# EAGLE design tvac_systems_interface (EAGLE 9.5.0)
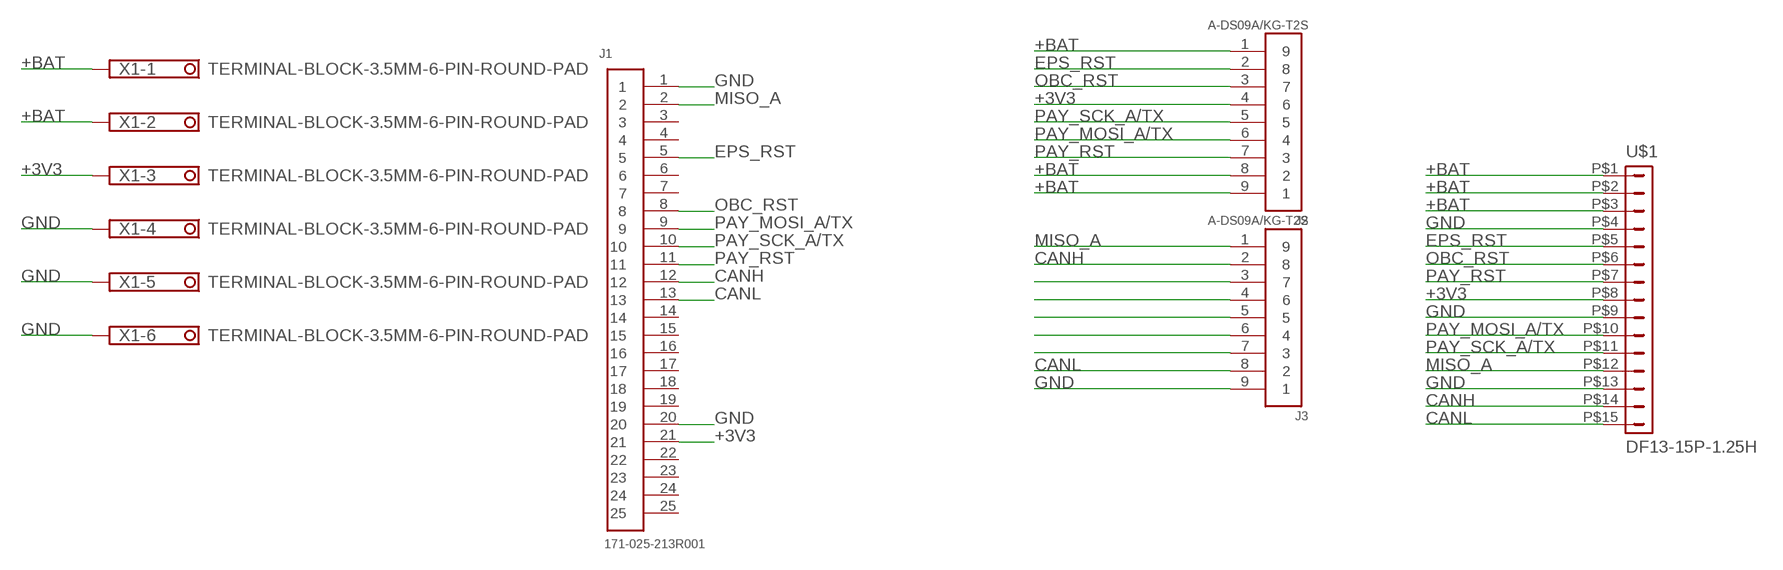
[diagram p0: schematic, sheet 1]

## Parts
J1  171-025-213R001  [171-025-213R001]
J2  A-DS09A/KG-T2S  [A-DS09A/KG-T2S]
J3  A-DS09A/KG-T2S  [A-DS09A/KG-T2S]
U$1  DF13-15P-1.25H  [DF13A-15P-1.25H]
X1  TERMINAL-BLOCK-3.5MM-6-PIN-ROUND-PAD  [TERMINAL-BLOCK-6-PIN-3.5MM-ROUND-PAD]

## Nets
+3V3 [power]: J1.21 J2.4 U$1.P$8 X1.3
+BAT [BAT]: J2.1 J2.8 J2.9 U$1.P$1 U$1.P$2 U$1.P$3 X1.1 X1.2
CANH: J1.12 J3.2 U$1.P$14
CANL: J1.13 J3.8 U$1.P$15
EPS_RST: J1.5 J2.2 U$1.P$5
GND [power]: J1.1 J1.20 J3.9 U$1.P$4 U$1.P$9 U$1.P$13 X1.4 X1.5 X1.6
MISO_A: J1.2 J3.1 U$1.P$12
N$11: J3.3
N$12: J3.4
N$13: J3.5
N$14: J3.6
N$15: J3.7
OBC_RST: J1.8 J2.3 U$1.P$6
PAY_MOSI_A/TX: J1.9 J2.6 U$1.P$10
PAY_RST: J1.11 J2.7 U$1.P$7
PAY_SCK_A/TX: J1.10 J2.5 U$1.P$11
Unconnected: J1.3 J1.4 J1.6 J1.7 J1.14 J1.15 J1.16 J1.17 J1.18 J1.19 J1.22 J1.23 J1.24 J1.25

## Library data of the parts
J1 = D-Sub Connectors:171-025-213R001: CONN D-SUB RCPT 25P PNL MNT SLDR Manufacturer's datasheet <https://www.norcomp.net/rohspdfs/Connectors/17Y/171/171-YYY-213RYY1.pdf>; CREATED_BY: PCBLayout.com; DIGIKEY_PART_NO: 4225FE-ND; MANUFACTURER: NorComp Inc.; MPN: 171-025-213R001
J2 J3 = D-Sub Connectors:A-DS09A/KG-T2S: CONN D-SUB PLUG 9POS R/A SOLDER Manufacturer's datasheet <http://www.assmann-wsw.com/fileadmin/datasheets/ASS_4888_CO.pdf>; CREATEDBY: PCBLayout.com; DIGI_KEY_PART_NUMBER: AE10968-ND; MANUFACTURER: Assmann WSW Components; MPN: A-DS 09 A/KG-T2S
U$1 = con-hirose-df13:DF13-15P-1.25: DF13-15P 1.25mm Pitch Miniature Crimping Connector.
X1 = Rembrandt Electronics - Terminal Block 3-5mm v1-0:TERMINAL-BLOCK-3.5MM-6-PIN: Terminal Block 3.5mm Pitch: 3,5 mm Number of pins: 6 Created by Rembrandt Electronics www.rembrandtelectronics.com

## Net classes
1 power: width 0.762 mm

## Board
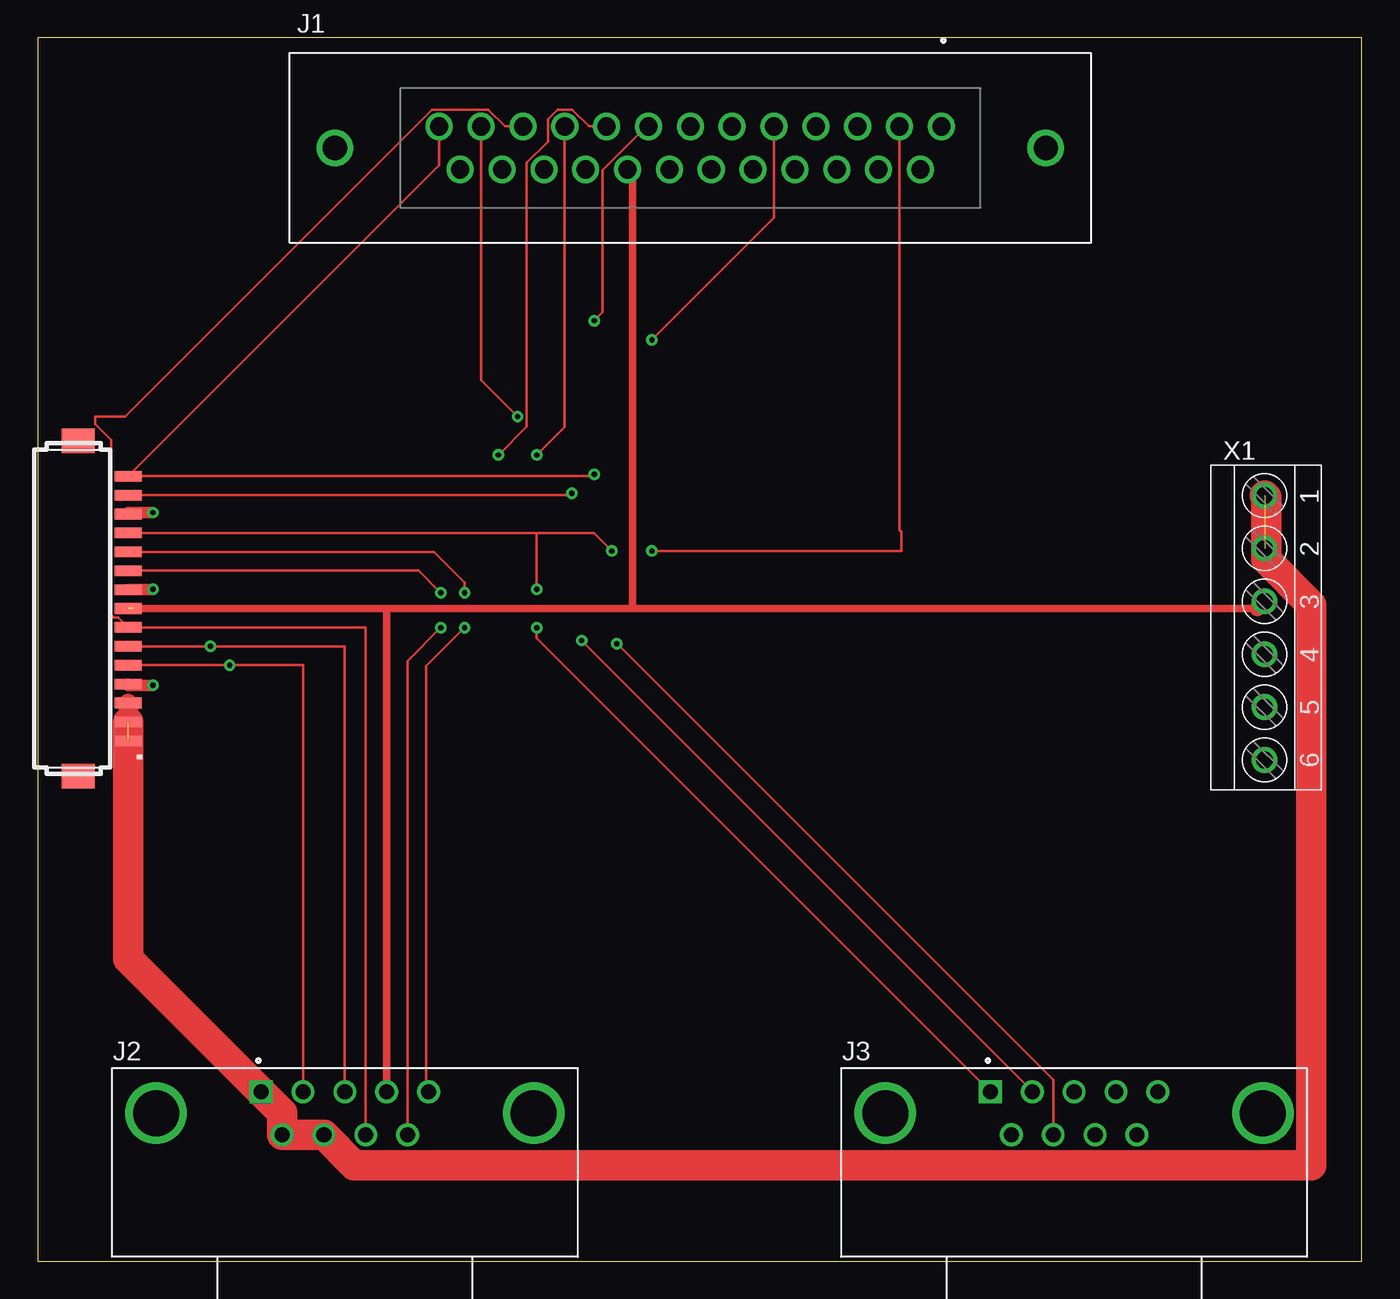
[diagram p1: board, top side]
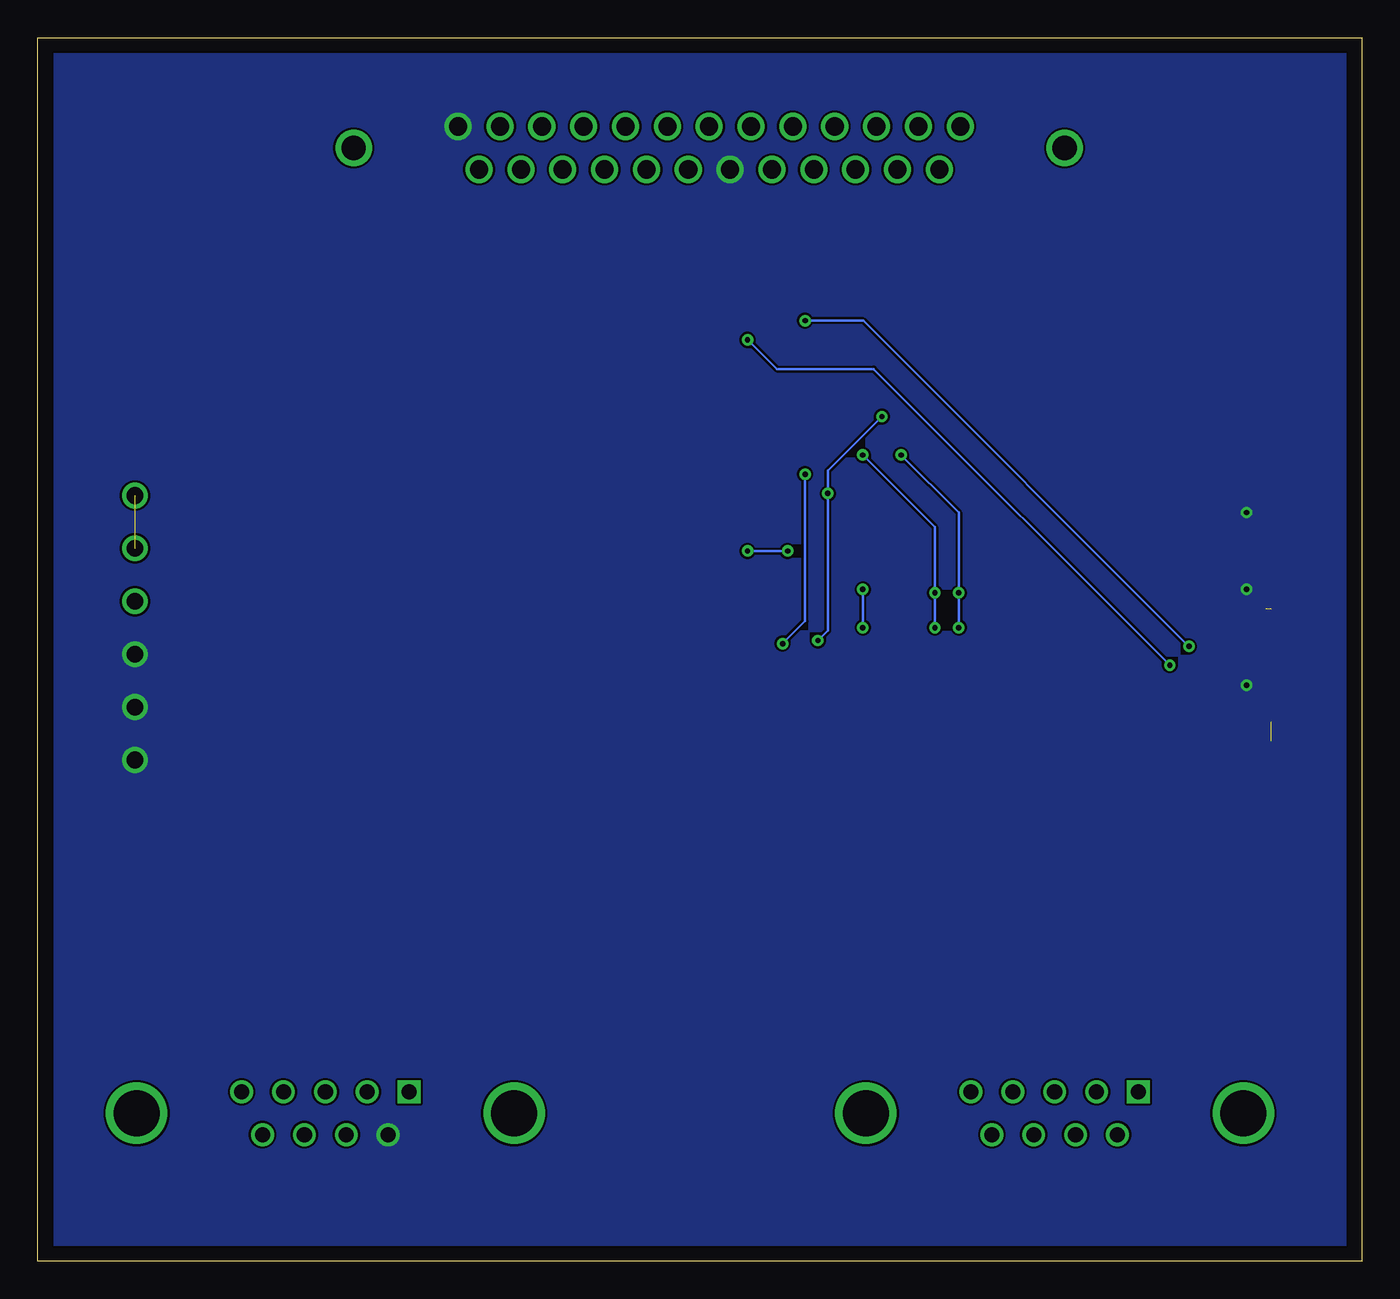
[diagram p2: board, bottom side, seen from below]

Size 87.61 x 80.95 mm. Coordinates in mm from the lower left corner, seen from the top.
Outline: 0,0 87.61,0 87.61,80.95 0,80.95 0,0
Copper layers (1*16): Top 0.035mm / dielectric 1.5mm / Bottom 0.035mm
Design rules "default": minimum track width 6mil, minimum drill 0.35mm, track to track 6mil, track to pad 6mil, pad to pad 6mil, via to via 6mil, smd to smd 6mil, copper to edge 40mil, drill to drill 6mil, minimum pad ring 10mil, minimum via ring 8mil, stop-mask expansion 4mil, vias tented up to drill 0mil, thermal gap 10mil

### Footprints (pad centres in the part's own frame; a part is rotated, then mirrored left to right if it is on the bottom)
171-025-213R001 = drill 1.194: 1 16.612,1.422; 2 13.843,1.422; 3 11.074,1.422; 4 8.306,1.422; 5 5.537,1.422; 6 2.769,1.422; 7 0,1.422; 8 -2.769,1.422; 9 -5.537,1.422; 10 -8.306,1.422; 11 -11.074,1.422; 12 -13.843,1.422; 13 -16.612,1.422; 14 15.227,-1.422; 15 12.459,-1.422; 16 9.69,-1.422; 17 6.921,-1.422; 18 4.153,-1.422; 19 1.384,-1.422; 20 -1.384,-1.422; 21 -4.153,-1.422; 22 -6.921,-1.422; 23 -9.69,-1.422; 24 -12.459,-1.422; 25 -15.227,-1.422 | drill 1.6: P$1 -23.52,0; P$2 23.52,0
A-DS09A/KG-T2S = drill 1 square: 1 -5.54,1.42 | drill 1: 2 -2.77,1.42; 3 0,1.42; 4 2.77,1.42; 5 5.54,1.42; 6 4.155,-1.42; 7 1.385,-1.42; 8 -1.385,-1.42; 9 -4.155,-1.42 | drill 3.05: P$1 -12.495,0; P$2 12.495,0
DF13A-15P-1.25H = smd 1.6 x 2.2: M$0 -11.1,2.4; M$1 11.1,2.4 | smd 0.7 x 1.8: P$1 -8.75,-0.9; P$2 -7.5,-0.9; P$3 -6.25,-0.9; P$4 -5,-0.9; P$5 -3.75,-0.9; P$6 -2.5,-0.9; P$7 -1.25,-0.9; P$8 0,-0.9; P$9 1.25,-0.9; P$10 2.5,-0.9; P$11 3.75,-0.9; P$12 5,-0.9; P$13 6.25,-0.9; P$14 7.5,-0.9; P$15 8.75,-0.9
TERMINAL-BLOCK-6-PIN-3.5MM-ROUND-PAD = drill 1.1 pad 1.7: 1 -8.75,-0.1; 2 -5.25,-0.1; 3 -1.75,-0.1; 4 1.75,-0.1; 5 5.25,-0.1; 6 8.75,-0.1

### Placement (x,y rotation side)
J1  43.18,73.66 0 top
J2  20.32,9.78 0 top
J3  68.58,9.78 0 top
U$1  5.08,43.18 90 top
X1  81.28,41.91 270 top

### Tracks (layer width: path | path; a pad name or v marks a point on that pad's centre or on a via)
+3V3  (1 unrouted)
  Top 0.508: 23.09,43.18 6.35,43.18 | J2.4 23.09,43.18 | 80.7,43.18 39.37,43.18 | 39.37,43.18 23.09,43.18 | 39.37,72.24 39.37,43.18
  Top 1.016: X1.3 80.7,43.18 | J1.21 39.37,72.24
+BAT  (2 unrouted)
  Top 1.27: U$1.P$3 U$1.P$2
  Top 2.032: U$1.P$2 5.98,20 J2.1 16.16,9.81 J2.9 J2.8 20.94,6.35 84.28,6.35 84.28,43.42 81.28,46.41 81.28,50.56 X1.1
CANH  (via drill 0.35)
  Top 0.152: J3.2 65.81,11.24 v35.99,41.07 | v35.33,50.8 35.21,50.68 U$1.P$14 | J1.12 29.34,58.29 v31.75,55.88
  Bottom 0.152: v35.99,41.07 35.33,41.72 v35.33,50.8 35.33,52.3 v31.75,55.88
CANL  (via drill 0.35)
  Top 0.152: v36.83,52.07 36.69,51.93 U$1.P$15 26.57,72.52 J1.13 | v38.32,40.86 67.19,11.98 J3.8
  Bottom 0.152: v38.32,40.86 36.83,42.34 v36.83,52.07
EPS_RST  (via drill 0.35)
  Top 0.152: U$1.P$5 v12.7,39.43 17.55,39.43 J2.2 | J1.5 48.72,69.04 v40.64,60.96
  Bottom 0.152: v12.7,39.43 32.3,59.03 38.71,59.03 v40.64,60.96
GND  (via drill 0.35)
  Top 0.762: U$1.P$4 5.98,38.1 v7.62,38.1 | U$1.P$9 5.98,44.45 v7.62,44.45 | U$1.P$13 5.98,49.53 v7.62,49.53
  pour Bottom (no thermals): 0,80.01 86.36,80.01 86.36,73.66 86.36,1.27 80.01,1.27 1.27,1.27 0,1.27
MISO_A  (via drill 0.35)
  Top 0.152: J1.2 57.02,48.39 57.15,48.26 57.15,46.99 v40.64,46.99 | U$1.P$12 33.02,48.18 | 33.02,48.18 36.8,48.18 v37.99,46.99 | J3.1 33.02,41.22 v33.02,41.91 | v33.02,44.45 33.02,48.18
  Bottom 0.152: v40.64,46.99 v37.99,46.99 | v33.02,41.91 v33.02,44.45
OBC_RST  (via drill 0.35)
  Top 0.152: U$1.P$6 v11.43,40.68 20.32,40.68 J2.3 | J1.8 40.28,75.08 37.38,72.18 37.38,62.78 v36.83,62.23
  Bottom 0.152: v36.83,62.23 32.98,62.23 v11.43,40.68
PAY_MOSI_A/TX  (via drill 0.35)
  Top 0.152: v26.67,41.91 24.48,39.72 J2.6 | U$1.P$10 25.21,45.68 v26.67,44.22 | v30.48,53.34 32.36,55.22 32.36,72.69 33.75,74.09 33.75,75.55 34.41,76.21 35.34,76.21 36.46,75.08 J1.9
  Bottom 0.152: v26.67,41.91 v26.67,44.22 26.67,49.53 v30.48,53.34
PAY_RST
  Top 0.152: J2.7 21.7,41.93 U$1.P$7 5.31,42.6 4.99,42.6 4.85,42.73 4.85,54.33 3.81,55.37 3.81,55.88 5.78,55.88 26.1,76.21 29.8,76.21 30.93,75.08 J1.11
PAY_SCK_A/TX  (via drill 0.35)
  Top 0.152: v28.25,44.22 28.25,44.9 26.21,46.93 U$1.P$11 | v28.25,41.91 25.7,39.37 25.7,11.35 J2.5 | v33.02,53.34 34.87,55.19 J1.10
  Bottom 0.152: v28.25,41.91 v28.25,44.22 28.25,48.56 v33.02,53.34